# Altium schematic sheet RTC.SchDoc
size A3; SheetNumber: 5; SheetTotal: 9
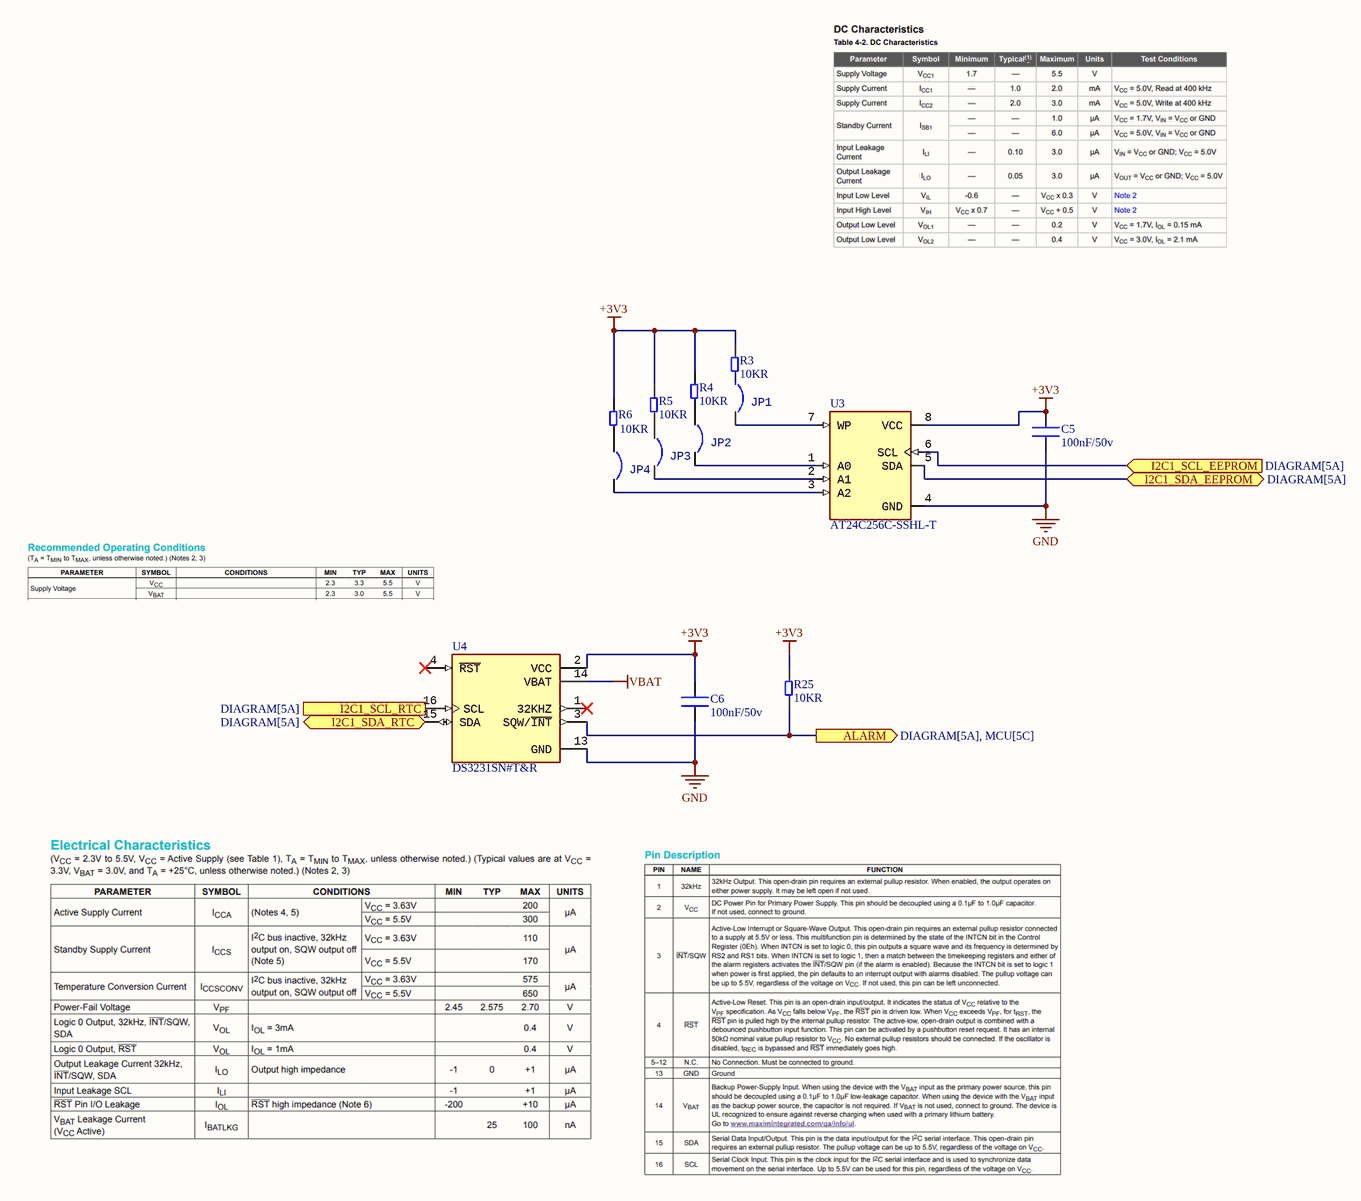
[diagram p0: RTC.SchDoc]

## Parts
C5  100nF/50v  [CAP-CER-0805]
C6  100nF/50v  [CAP-CER-0805]
JP1  JUMPER-2POS  [JUMPER-2POS-2.54]  (value not drawn)
JP2  JUMPER-2POS  [JUMPER-2POS-2.54]  (value not drawn)
JP3  JUMPER-2POS  [JUMPER-2POS-2.54]  (value not drawn)
JP4  JUMPER-2POS  [JUMPER-2POS-2.54]  (value not drawn)
R3  10KR  [RES-SMD-0805]
R4  10KR  [RES-SMD-0805]
R5  10KR  [RES-SMD-0805]
R6  10KR  [RES-SMD-0805]
R25  10KR  [RES-SMD-0805]
U3  AT24C256C-SSHL-T  [AT24C256C-SSHL-T]
U4  DS3231SN#T&R  [DS3231SN_SOIC127P1032X265-16N]

## Ports
ALARM (out, see DIAGRAM[5A], MCU[5C]), I2C1_SCL_EEPROM (in, see DIAGRAM[5A]), I2C1_SCL_RTC (in, see DIAGRAM[5A]), I2C1_SDA_EEPROM (bidir, see DIAGRAM[5A]), I2C1_SDA_RTC (bidir, see DIAGRAM[5A])

## Nets
+3V3: C5.2 C6.2 R3.2 R4.2 R5.2 R6.2 R25.2 U3.8(VCC) U4.2(VCC)
GND: C5.1 C6.1 U3.4(GND) U4.13(GND)
VBAT: U4.14(VBAT)
ALARM: R25.1 U4.3(SQW/~{INT}) ; port ALARM
I2C1_SCL_EEPROM: U3.6(SCL) ; port I2C1_SCL_EEPROM
I2C1_SCL_RTC: U4.16(SCL) ; port I2C1_SCL_RTC
I2C1_SDA_EEPROM: U3.5(SDA) ; port I2C1_SDA_EEPROM
I2C1_SDA_RTC: U4.15(SDA) ; port I2C1_SDA_RTC
NetJP1_1: JP1.1 R3.1
NetJP1_2: JP1.2 U3.7(WP)
NetJP2_1: JP2.1 R4.1
NetJP2_2: JP2.2 U3.1(A0)
NetJP3_1: JP3.1 R5.1
NetJP3_2: JP3.2 U3.2(A1)
NetJP4_1: JP4.1 R6.1
NetJP4_2: JP4.2 U3.3(A2)

Not connected (* = marked no-connect by the designer): U4 1(32KHZ)* 4(~{RST})*

## Library data of the parts
C5 C6 = CAP-CER
JP1-JP4 = ID-7: Design Item ID: ID-7
R3-R6 R25 = RES_SMD
U3 = ID-9: EEPROM Memory IC 256Kbit I2C 1 MHz 550 ns 8-SOIC; Design Item ID: ID-9; Mfr# #: AT24C256C-SSHL-T
U4 = ID-8: Real Time Clock (RTC) IC Clock/Calendar I2C, 2-Wire Serial 16-SOIC (0.295", 7.50mm Width); Design Item ID: ID-8; Mfr# #: DS3231SN#T&R